# EAGLE design PowerControlShield 1.1 (EAGLE 5.11)
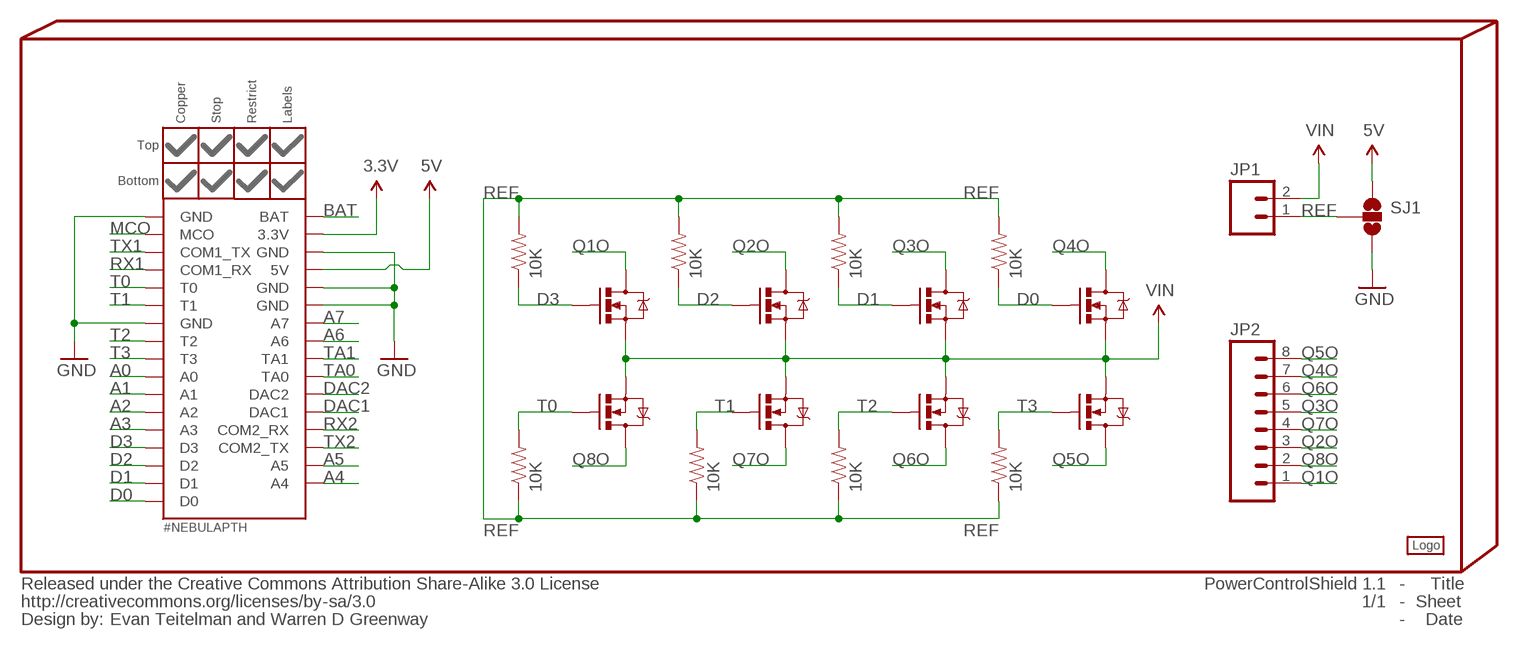
[diagram p0: schematic, sheet 1]

## Parts
INFO2  Evan Teitelman and Warren D Greenway  %CC-BY-SA  [%CC-BY-SA]
JP1  M02PTH  [1X02]
JP2  M081X08  [1X08]
LOGO1  #LOGOA-THICK  [#LOGOA-THICK]
NEBULA1  #NEBULAPTH  [#NEBULA-PTH]
NEBULAPART1  #NEBULA-PARTPADS  [#NEBULA-PADS]
PART1  #NEBULA-PARTSTOP  [#NEBULA-STOP]
PART2  #NEBULA-PARTRESTRICT  [#NEBULA-RESTRICT]
PART4  #NEBULA-PARTLABELS-TOP  [#NEBULA-LABELS-TOP]
Q1  MOSFET-NCHANNELSMD  [SOT23-3]
Q2  MOSFET-NCHANNELSMD  [SOT23-3]
Q3  MOSFET-NCHANNELSMD  [SOT23-3]
Q4  MOSFET-NCHANNELSMD  [SOT23-3]
Q5  MOSFET-NCHANNELSMD  [SOT23-3]
Q6  MOSFET-NCHANNELSMD  [SOT23-3]
Q7  MOSFET-NCHANNELSMD  [SOT23-3]
Q8  MOSFET-NCHANNELSMD  [SOT23-3]
R1  10K  RESISTOR0402-RES  [0402-RES]
R2  10K  RESISTOR0402-RES  [0402-RES]
R3  10K  RESISTOR0402-RES  [0402-RES]
R4  10K  RESISTOR0402-RES  [0402-RES]
R5  10K  RESISTOR0402-RES  [0402-RES]
R6  10K  RESISTOR0402-RES  [0402-RES]
R7  10K  RESISTOR0402-RES  [0402-RES]
R8  10K  RESISTOR0402-RES  [0402-RES]
SJ1  SOLDERJUMPER_2WAYPASTE2&3  [SJ_3_PASTE2&3]

## Nets
3.3V: NEBULA1.3.3V ; supply symbol labelled @3.3V
5V: NEBULA1.5V SJ1.1 ; supply symbol labelled @5V
A0: NEBULA1.A0
A1: NEBULA1.A1
A2: NEBULA1.A2
A3: NEBULA1.A3
A4: NEBULA1.A4
A5: NEBULA1.A5
A6: NEBULA1.A6
A7: NEBULA1.A7
BAT: NEBULA1.BAT
D0: NEBULA1.D0 Q4.1(G) R8.1
D1: NEBULA1.D1 Q3.1(G) R3.1
D2: NEBULA1.D2 Q2.1(G) R4.1
D3: NEBULA1.D3 Q1.1(G) R5.1
DAC1: NEBULA1.DAC1
DAC2: NEBULA1.DAC2
GND: NEBULA1.GND1(GND) NEBULA1.GND2(GND) NEBULA1.GND3(GND) NEBULA1.GND4(GND) NEBULA1.GND5(GND) SJ1.3 ; supply symbol labelled @GND
MCO: NEBULA1.MCO
Q1O: JP2.1 Q1.3(D)
Q2O: JP2.3 Q2.3(D)
Q3O: JP2.5 Q3.3(D)
Q4O: JP2.7 Q4.3(D)
Q5O: JP2.8 Q5.3(D)
Q6O: JP2.6 Q6.3(D)
Q7O: JP2.4 Q7.3(D)
Q8O: JP2.2 Q8.3(D)
REF: JP1.1 R1.1 R2.1 R3.2 R4.2 R5.2 R6.1 R7.1 R8.2 SJ1.2
RX1: NEBULA1.COM1_RX
RX2: NEBULA1.COM2_RX
T0: NEBULA1.T0 Q8.1(G) R6.2
T1: NEBULA1.T1 Q7.1(G) R1.2
T2: NEBULA1.T2 Q6.1(G) R2.2
T3: NEBULA1.T3 Q5.1(G) R7.2
TA0: NEBULA1.TA0
TA1: NEBULA1.TA1
TX1: NEBULA1.COM1_TX
TX2: NEBULA1.COM2_TX
VIN: JP1.2 Q1.2(S) Q2.2(S) Q3.2(S) Q4.2(S) Q5.2(S) Q6.2(S) Q7.2(S) Q8.2(S) ; supply symbol labelled @VIN

## Library data of the parts
INFO2 = PygmyBoards:%CC-BY-SA: Creative Commons Attribution-ShareAlike License <http://creativecommons.org/licenses/by-sa/3.0/>
JP1 = SparkFun:M02: Header 2 Standard 2-pin 0.1" header. Use with straight break away headers (SKU : PRT-00116), right angle break away headers (PRT-00553), swiss pins (PRT-00743), machine pins (PRT-00117), and female headers (PRT-00115). Molex polarized connector foot print use with SKU : PRT-08233 with associated crimp pins and housings.
JP2 = SparkFun:M08: Header 8 Standard 8-pin 0.1" header. Use with straight break away headers (SKU : PRT-00116), right angle break away headers (PRT-00553), swiss pins (PRT-00743), machine pins (PRT-00117), and female headers (PRT-00115).
LOGO1 = PygmyBoards:#LOGO
NEBULA1 = PygmyBoards:#NEBULA: Nebula Board and Shield Footprint Pads This is the only absolutely required part for the footprint. The parts in "#NEBULA-PART" are merely aesthetic. A circular board outline should be .001" thick and 1.005" in diameter (Reference circle on the Document (48) layer provided).
NEBULAPART1 PART1 PART2 PART4 = PygmyBoards:#NEBULA-PART: Nebula Board and Shield Footprint Parts These parts are only functional when combined with the pads in "#NEBULA".
Q1-Q8 = SparkFun:MOSFET-NCHANNEL
R1-R8 = SparkFun:RESISTOR: Resistor Basic schematic elements and footprints for 0603, 1206, and PTH resistors.
SJ1 = SparkFun:SOLDERJUMPER_2WAY: Solder Jumper 2 way solder jumper

## Board
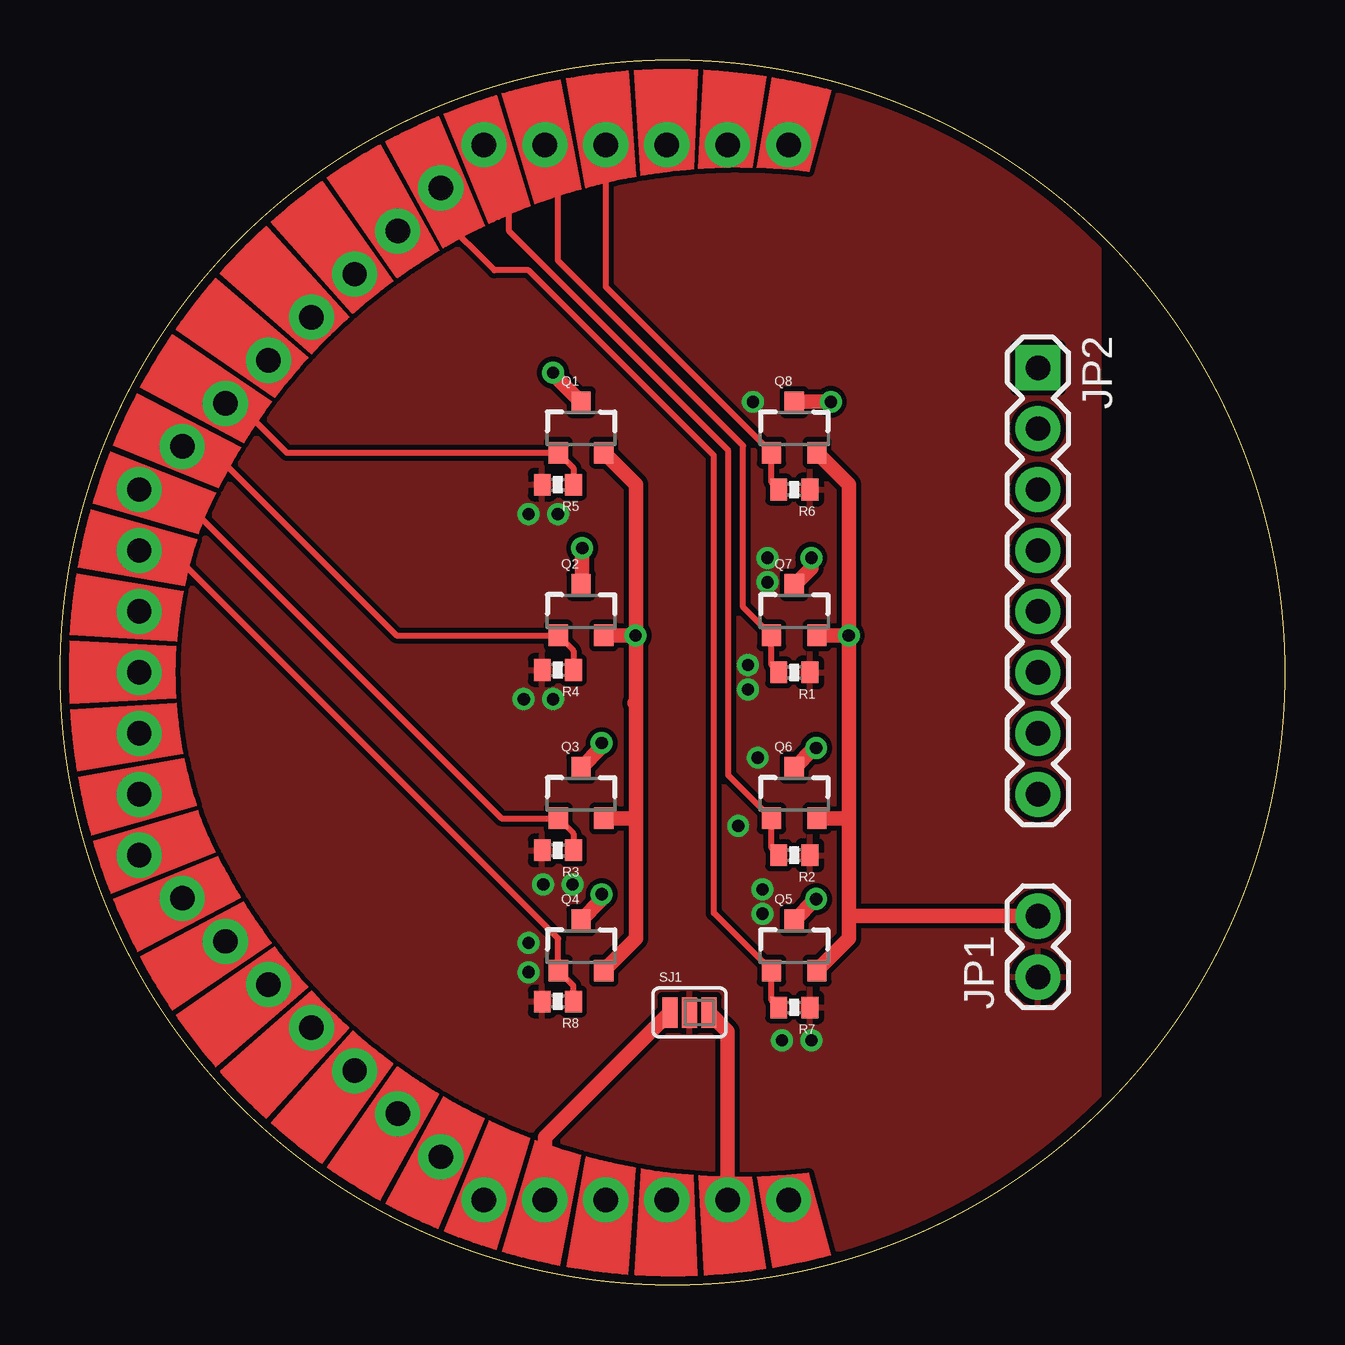
[diagram p1: board, top side]
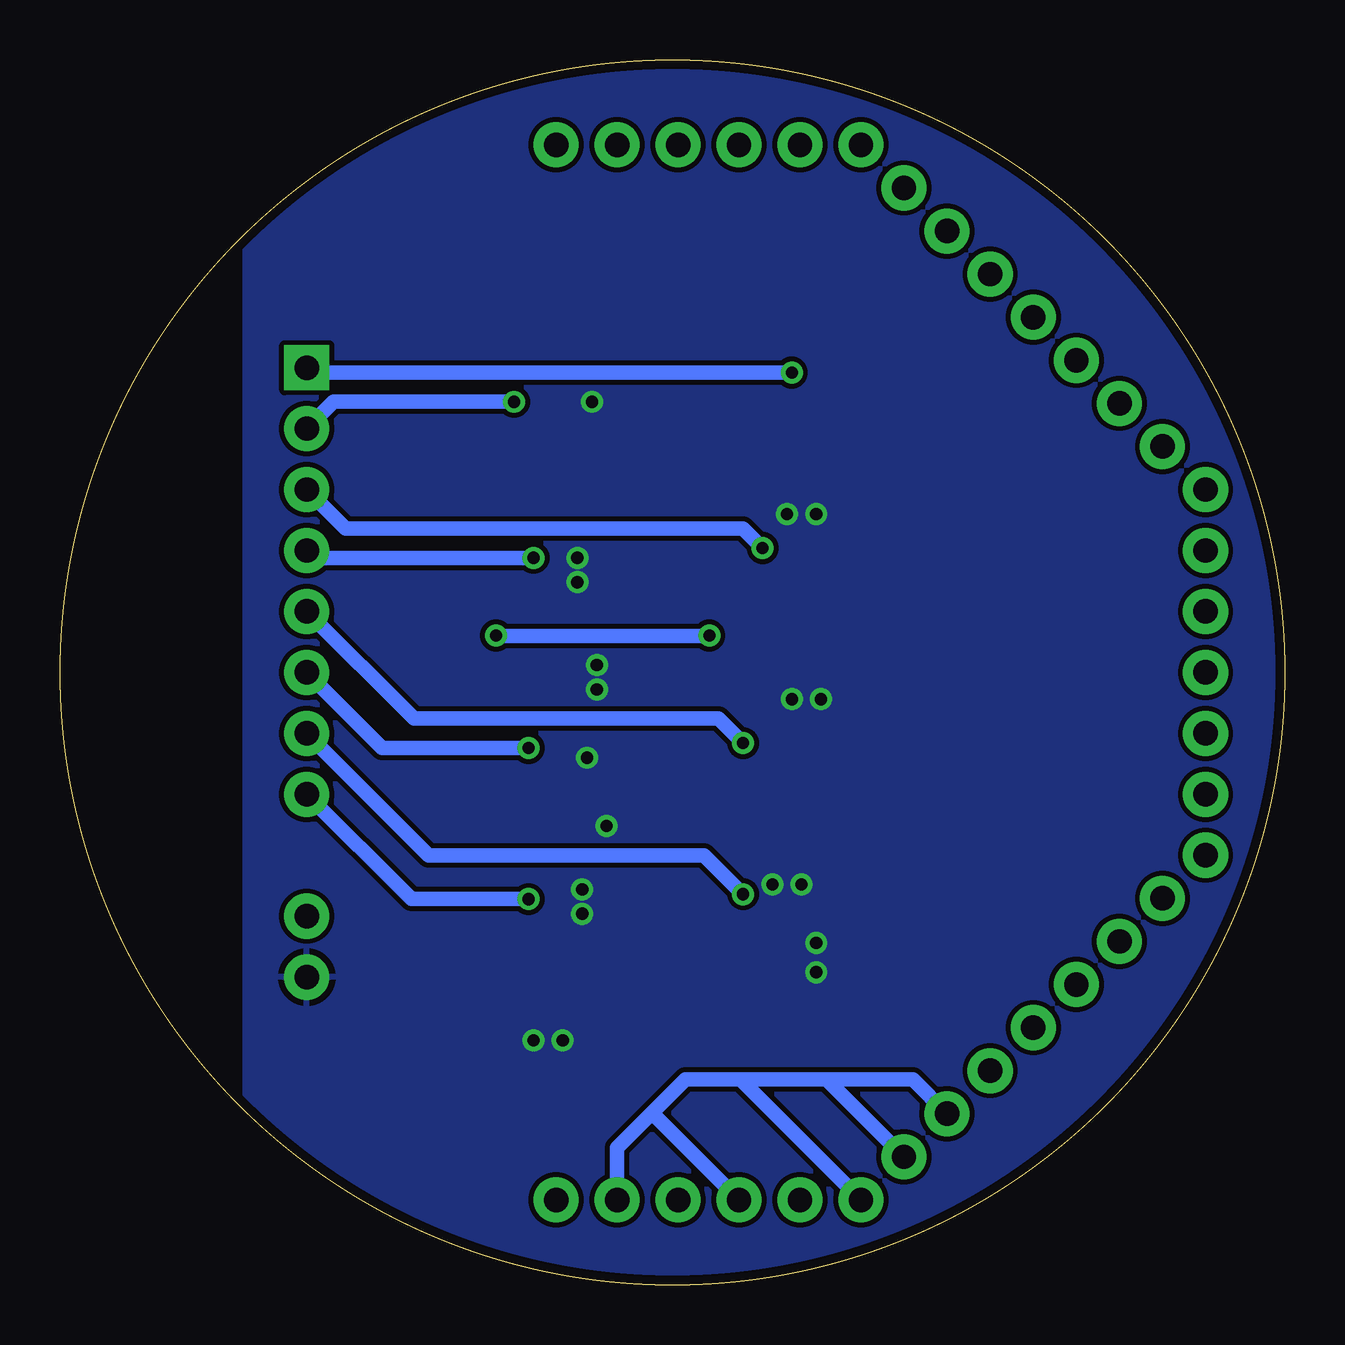
[diagram p2: board, bottom side, seen from below]

Size 51.05 x 51.05 mm. Coordinates in mm from the lower left corner, seen from the top.
Outline: circle at 25.53,25.53 radius 25.53
Copper layers (1*16): Top 0.035mm / dielectric 1.5mm / Bottom 0.035mm
Design rules "PDX (Production)": minimum track width 6mil, minimum drill 15mil, track to track 6mil, track to pad 6mil, pad to pad 4mil, via to via 6mil, smd to smd 4mil, copper to edge 15mil, drill to drill 6mil, minimum pad ring 10mil, minimum via ring 8mil, stop-mask expansion 4mil, vias tented up to drill 25mil, thermal gap 10mil

### Footprints (pad centres in the part's own frame; a part is rotated, then mirrored left to right if it is on the bottom)
1X02 = drill 1.016 pad 1.88 round: 1 0,0; 2 2.54,0
1X08 = drill 1.016 pad 1.88 square: 1 0,0 | drill 1.016 pad 1.88 round: 2 2.54,0; 3 5.08,0; 4 7.62,0; 5 10.16,0; 6 12.7,0; 7 15.24,0; 8 17.78,0
#NEBULA-PTH = drill 1.016 pad 1.88 round: 3.3V -25.637,-47.388; 5V -30.716,-47.388; A0 -36.848,-7.004; A1 -38.645,-8.8; A2 -40.44,-10.596; A3 -42.237,-12.392; A4 -47.625,-22.86; A5 -47.625,-25.4; A6 -40.44,-40.204; A7 -38.645,-42; BAT -20.557,-47.388; COM1_RX -25.636,-3.412; COM1_TX -23.096,-3.412; COM2_RX -47.625,-30.48; COM2_TX -47.625,-27.94; D0 -47.625,-20.32; D1 -47.625,-17.78; D2 -45.829,-15.984; D3 -44.032,-14.188; DAC1 -47.625,-33.02; DAC2 -45.829,-34.816; GND1 -36.848,-43.796; GND2 -35.052,-45.592; GND3 -33.256,-47.388; GND4 -28.177,-47.388; GND5 -23.097,-47.388; MCO -20.556,-3.412; T0 -28.176,-3.412; T1 -30.716,-3.412; T2 -33.256,-3.412; T3 -35.052,-5.208; TA0 -44.032,-36.612; TA1 -42.237,-38.408
SOT23-3 = smd 0.8 x 0.9: 1 -0.95,-1; 2 0.95,-1; 3 0,1.1
0402-RES = smd 0.7 x 0.9: 1 -0.65,0; 2 0.65,0
SJ_3_PASTE2&3 = smd 0.635 x 1.27: 1 -0.813,0; 2 0,0; 3 0.813,0

### Placement (x,y rotation side)
INFO2  -2.41,-10.03 0 top  (outside the outline)
JP1  40.77,12.83 90 top
JP2  40.77,38.23 270 top
LOGO1  26.8,34.42 0 bottom
NEBULA1  50.93,50.93 0 top
NEBULAPART1  50.93,50.93 0 top
PART1  50.93,50.93 0 top
PART2  50.93,50.93 0 top
PART4  50.93,50.93 0 top
Q1  21.72,35.69 0 top
Q2  21.72,28.07 0 top
Q3  21.72,20.45 0 top
Q4  21.72,14.1 0 top
Q5  30.61,14.1 0 top
Q6  30.61,20.45 0 top
Q7  30.61,28.07 0 top
Q8  30.61,35.69 0 top
R1  30.61,25.53 180 top
R2  30.61,17.91 180 top
R3  20.75,18.11 180 top
R4  20.75,25.63 180 top
R5  20.75,33.35 180 top
R6  30.61,33.15 180 top
R7  30.61,11.56 180 top
R8  20.75,11.81 180 top
SJ1  26.24,11.35 0 top

### Tracks (layer width: path | path; a pad name or v marks a point on that pad's centre or on a via)
5V
  Top 0.61: NEBULA1.5V 20.21,6.14 SJ1.1
D0
  Top 0.254: R8.1 21.4,12.46 Q4.1 20.77,14.44 4.6,30.61 NEBULA1.D0
D1
  Top 0.254: R3.1 21.4,18.81 Q3.1 18.4,19.45 4.7,33.15 NEBULA1.D1
D2
  Top 0.254: R4.1 21.4,26.43 Q2.1 14.03,27.07 6.15,34.94 NEBULA1.D2
D3
  Top 0.254: R5.1 21.4,34.05 Q1.1 9.46,34.69 7.41,36.74 NEBULA1.D3
GND
  Top 0.61: NEBULA1.GND5 27.83,10.57 SJ1.3
  Bottom 0.61: NEBULA1.GND1 15.51,8.56 19.1,8.56 | 26.53,7.02 24.99,8.56 22.69,8.56 | 26.53,7.02 27.83,5.71 NEBULA1.GND5 | 19.1,8.56 NEBULA1.GND2 | 22.69,8.56 19.1,8.56 | NEBULA1.GND3 22.69,8.56 | NEBULA1.GND4 26.23,7.02 26.53,7.02
Q1O  (via drill 0.51)
  Top 0.61: Q1.3 20.55,37.95 v20.55,38.02
  Bottom 0.61: v20.55,38.02 40.56,38.02 JP2.1
Q2O  (via drill 0.51)
  Top 0.61: Q2.3 21.77,29.22 v21.77,30.71
  Bottom 0.61: v21.77,30.71 22.58,31.52 39.14,31.52 JP2.3
Q3O  (via drill 0.51)
  Top 0.61: Q3.3 22.58,22.41 v22.58,22.58
  Bottom 0.61: v22.58,22.58 23.6,23.6 36.3,23.6 JP2.5
Q4O  (via drill 0.51)
  Top 0.61: Q4.3 22.58,16.06 v22.58,16.28
  Bottom 0.61: v22.58,16.28 24.21,17.91 35.69,17.91 JP2.7
Q5O  (via drill 0.51)
  Top 0.61: Q5.3 31.49,16.08 v31.52,16.08
  Bottom 0.61: v31.52,16.08 36.4,16.08 JP2.8
Q6O  (via drill 0.51)
  Top 0.61: Q6.3 31.44,22.38 v31.52,22.38
  Bottom 0.61: v31.52,22.38 37.62,22.38 JP2.6
Q7O  (via drill 0.51)
  Top 0.61: Q7.3 31.32,29.88 v31.32,30.3
  Bottom 0.61: v31.32,30.3 40.46,30.3 JP2.4
Q8O  (via drill 0.51)
  Top 0.61: Q8.3 30.62,36.81 v32.13,36.81
  Bottom 0.61: v32.13,36.81 39.65,36.81 JP2.2
REF  (via drill 0.51)
  other vias: 29.29,16.48 29.29,15.47 29.49,29.29 29.49,30.3 28.68,25.83 28.68,24.82 19.53,13.03 20.14,16.69 21.36,16.69 19.33,24.41 20.55,24.41 29.08,21.97 28.88,36.8 19.53,32.13 20.75,32.13 30.1,10.19 31.32,10.19 19.53,14.25 28.27,19.13
  pour Top (isolate 0.203): -1.14,-1.14 43.31,-1.14 43.31,52.2 -1.14,52.2
  pour Bottom (isolate 0.203): -2.41,-2.41 43.31,-2.41 43.31,53.47 -2.41,53.47
T0
  Top 0.254: R6.2 29.66,33.45 Q8.1 22.75,41.59 NEBULA1.T0
T1
  Top 0.254: R1.2 29.66,25.83 Q7.1 28.47,28.25 28.47,34.98 20.75,42.7 20.75,46.97 NEBULA1.T1
T2
  Top 0.254: R2.2 29.66,18.21 Q6.1 27.86,21.24 27.86,34.77 18.72,43.92 18.72,46.47 NEBULA1.T2
T3
  Top 0.254: R7.2 29.66,11.86 Q5.1 27.25,15.5 27.25,34.57 19.53,42.29 18.11,42.29 15.88,44.53 NEBULA1.T3
VIN  (via drill 0.51)
  Top 0.61: Q1.2 24,33.35 24,27.05 | 24,19.33 24,14.43 Q4.2 | 24,19.33 24,24.21 | 24,24.21 24,27.05 | Q3.2 23.88,19.45 24,19.33 | Q2.2 v23.99,27.07 24,27.05 | Q8.2 32.89,33.35 32.89,27.05 | 32.89,19.33 32.89,15.37 | 32.89,15.37 32.89,14.43 Q5.2 | 32.89,27.05 32.89,19.33 | Q6.2 32.78,19.45 32.89,19.33 | 32.89,27.05 v32.88,27.07 Q7.2 | 24,24.21 23.95,24.26 | 32.89,15.37 JP1.2
  Bottom 0.61: v23.99,27.07 23.99,27.05 32.88,27.05 v32.88,27.07

### Text on the board
bTest: Pygmy Power Control Shield | Version 1 | Evan Teitelman | Designed By: | Warren D Greenway
Document: Pygmy Power Control Shield | Version 1.0 | Standard Grid: 50mil | Routing Grids: 8mil / 4mil
_tsilk: 1 | 2 | 3 | 4 | 5 | 6 | 7 | 8 | Ref | Vin | 5V | 0V | Ext Ref